# EAGLE design Battery_Monitoring_with_kill_Schematic (EAGLE 8.4.0)
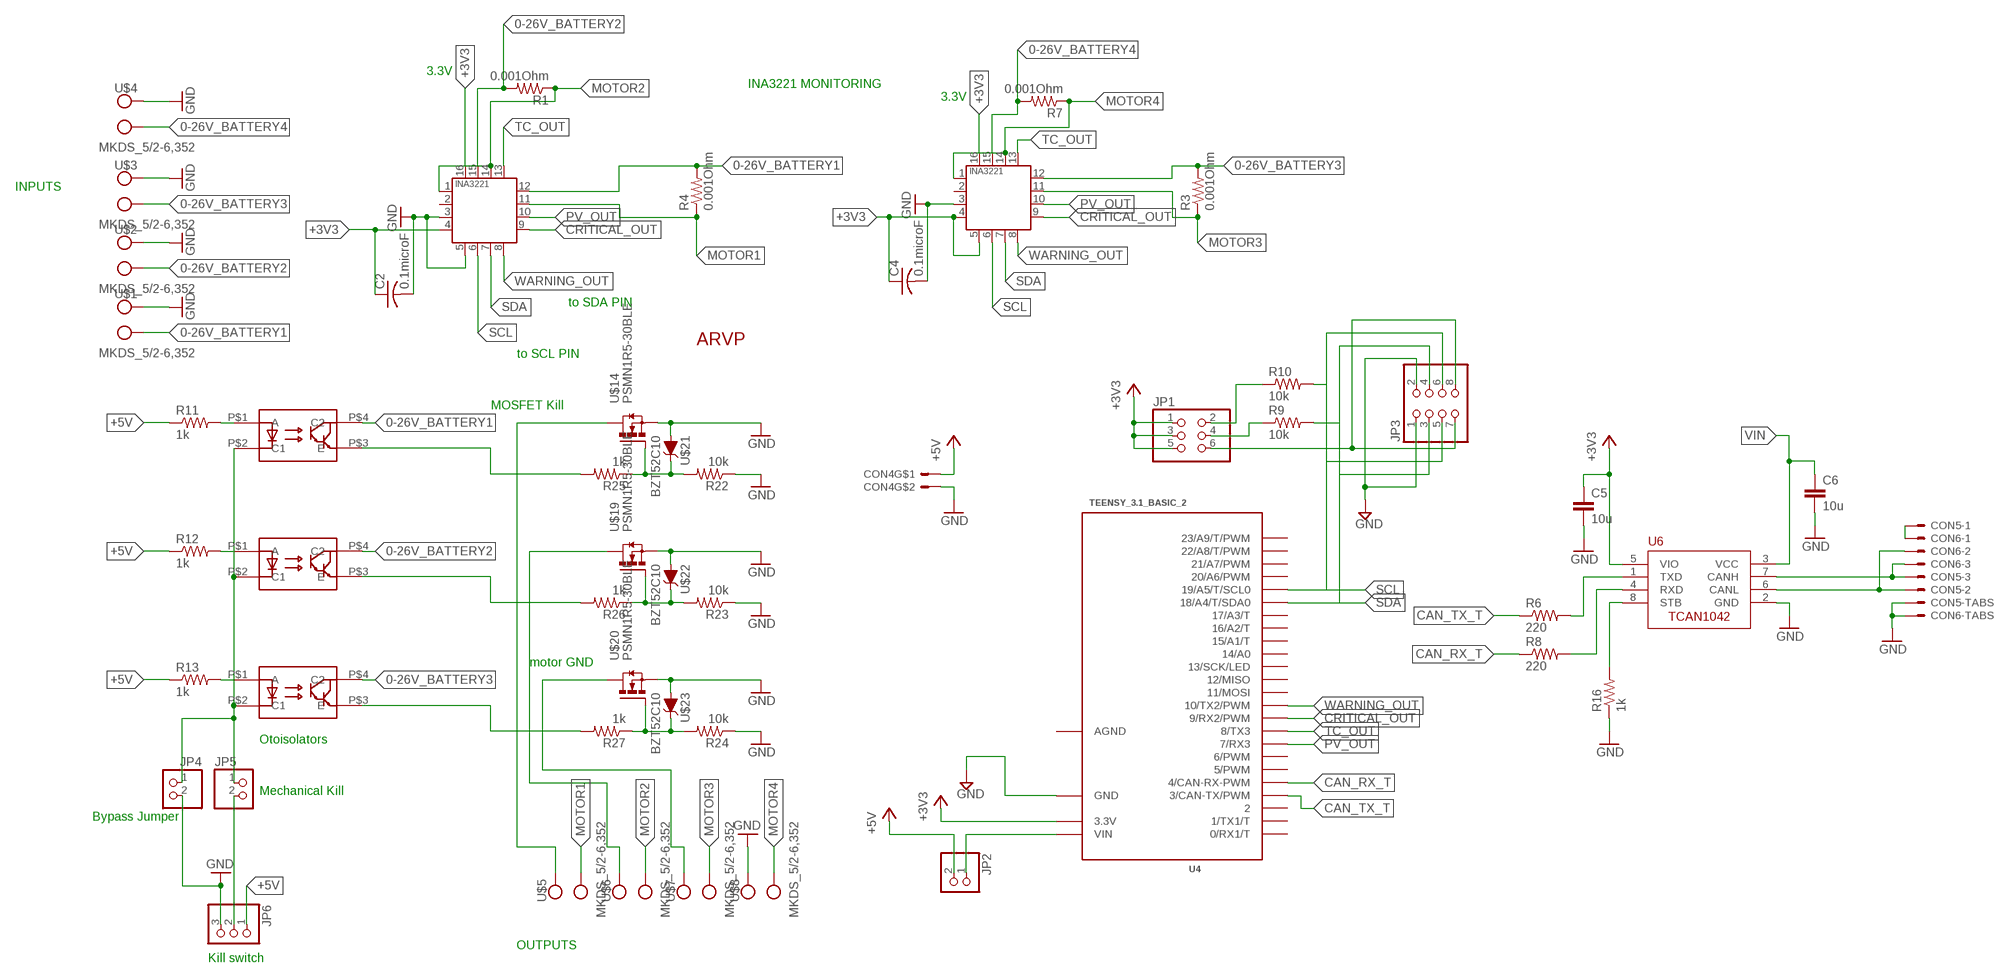
[diagram p0: schematic, sheet 1]

## Parts
C2  0.1microF  C-USC2012  [C2012]
C4  0.1microF  C-USC2012  [C2012]
C5  10u  C-EUC0805  [C0805]
C6  10u  C-EUC0805  [C0805]
CON4  MOLEX_5566-2  [5566-2]
CON5  S3B-PH-SM4-TB  [S3B-PH-SM4-TB]
CON6  S3B-PH-SM4-TB  [S3B-PH-SM4-TB]
JP1  PINHD-2X3  [2X03]
JP2  PINHD-1X2  [1X02]
JP3  PINHD-2X4  [2X04]
JP4  PINHD-1X2  [1X02]
JP5  PINHD-1X2  [1X02]
JP6  PINHD-1X3  [1X03]
R1  0.001Ohm  HCS3920FT1L00  [3920]
R3  0.001Ohm  HCS3920FT1L00  [3920]
R4  0.001Ohm  HCS3920FT1L00  [3920]
R6  220  R-US_R0805  [R0805]
R7  0.001Ohm  HCS3920FT1L00  [3920]
R8  220  R-US_R0805  [R0805]
R9  10k  R-US_R1206  [R1206]
R10  10k  R-US_R1206  [R1206]
R11  1k  R-US_R0805  [R0805]
R12  1k  R-US_R0805  [R0805]
R13  1k  R-US_R0805  [R0805]
R16  1k  R-US_R0805  [R0805]
R22  10k  R-US_M1206  [M1206]
R23  10k  R-US_M1206  [M1206]
R24  10k  R-US_M1206  [M1206]
R25  1k  R-US_M1206  [M1206]
R26  1k  R-US_M1206  [M1206]
R27  1k  R-US_M1206  [M1206]
U1  INA3221.  [HVQFN16_4X4]
U2  INA3221.  [HVQFN16_4X4]
U4  TEENSY_3.1_BASIC_2  [TEENSY_3.1_BASIC_2]
U6  TCAN1042HVDR  [SO-8]
U$1  MKDS_5/2-6,352  [MKDS_5/2-6,35]
U$2  MKDS_5/2-6,352  [MKDS_5/2-6,35]
U$3  MKDS_5/2-6,352  [MKDS_5/2-6,35]
U$4  MKDS_5/2-6,352  [MKDS_5/2-6,35]
U$5  MKDS_5/2-6,352  [MKDS_5/2-6,35]
U$6  MKDS_5/2-6,352  [MKDS_5/2-6,35]
U$7  MKDS_5/2-6,352  [MKDS_5/2-6,35]
U$8  MKDS_5/2-6,352  [MKDS_5/2-6,35]
U$10  ARVP_LOGO  [ARVP]
U$11  TCLD1000CT  [SOP-4L]
U$12  TCLD1000CT  [SOP-4L]
U$13  TCLD1000CT  [SOP-4L]
U$14  PSMN1R5-30BLE  [SOT404/D2PAK]
U$19  PSMN1R5-30BLE  [SOT404/D2PAK]
U$20  PSMN1R5-30BLE  [SOT404/D2PAK]
U$21  BZT52C10  [SOD-123]
U$22  BZT52C10  [SOD-123]
U$23  BZT52C10  [SOD-123]

## Nets
0-26V_BATTERY1: R4.P$2 U1.12(IN+1) U$1.1(KL) U$11.P$4(C2)
0-26V_BATTERY2: R1.P$2 U1.15(IN+2) U$2.1(KL) U$12.P$4(C2)
0-26V_BATTERY3: R3.P$2 U2.12(IN+1) U$3.1(KL) U$13.P$4(C2)
0-26V_BATTERY4: R7.P$2 U2.15(IN+2) U$4.1(KL)
+3V3: C2.1 C4.1 C5.1 JP1.1 JP1.3 JP1.5 U1.4(VS) U1.16(VPU) U2.4(VS) U2.5(A0) U2.16(VPU) U4.3.3V U6.5(VIO)
+5V: CON4.1 JP2.2 JP6.1 R11.1 R12.1 R13.1
CAN_RX1: R8.2 U6.4(RXD)
CAN_RX_T: R8.1 U4.4(4/CAN-RX-PWM)
CAN_TX2: R6.2 U6.1(TXD)
CAN_TX_T: R6.1 U4.3(3/CAN-TX/PWM)
CANH1: CON5.P$3 CON6.P$3 U6.7(CANH)
CANL1: CON5.P$2 CON6.P$2 U6.6(CANL)
CANSH1: CON5.P$1 CON6.P$1
CRITICAL_OUT: U1.9(CRITICAL) U2.9(CRITICAL) U4.9(9/RX2/PWM)
E1: R25.2 U$11.P$3(E)
E2: R26.2 U$12.P$3(E)
E3: R27.2 U$13.P$3(E)
GND: C2.2 C4.2 C5.2 C6.2 CON4.2 CON5.P$4 CON5.P$5 CON6.P$4 CON6.P$5 JP3.1 JP3.2 JP4.2 JP6.3 R16.1 R22.1 R23.1 R24.1 U1.3(GND) U1.5(A0) U2.3(GND) U4.GND U6.2(GND) U$1.2(KL1) U$2.2(KL1) U$3.2(KL1) U$4.2(KL1) U$8.2(KL1) U$14.3S(S) U$19.3S(S) U$20.3S(S) U$21.P$2(A) U$22.P$2(A) U$23.P$2(A)
I2C_3V1: JP1.6 JP3.7 JP3.8
MD1: U$5.2(KL1) U$14.2D(D)
MD2: U$6.2(KL1) U$19.2D(D)
MD3: U$7.2(KL1) U$20.2D(D)
MG1: R22.2 R25.1 U$14.1G(G) U$21.P$1(C)
MG2: R23.2 R26.1 U$19.1G(G) U$22.P$1(C)
MG3: R24.2 R27.1 U$20.1G(G) U$23.P$1(C)
MOTOR1: R4.P$1 U1.11(IN-1) U$5.1(KL)
MOTOR2: R1.P$1 U1.1(IN-3) U1.14(IN-2) U$6.1(KL)
MOTOR3: R3.P$1 U2.11(IN-1) U$7.1(KL)
MOTOR4: R7.P$1 U2.1(IN-3) U2.14(IN-2) U$8.1(KL)
N$1: R11.2 U$11.P$1(A)
N$2: R12.2 U$12.P$1(A)
N$3: R13.2 U$13.P$1(A)
N$4: JP4.1 JP5.1 U$11.P$2(C1) U$12.P$2(C1) U$13.P$2(C1)
N$5: JP5.2 JP6.2
PV_OUT: U1.10(PV) U2.10(PV) U4.7(7/RX3)
SCL: JP3.5 JP3.6 R10.2 U1.6(SCL) U2.6(SCL) U4.19/A5(19/A5/T/SCL0)
SCL_3V1: JP1.2 R10.1
SDA: JP3.3 JP3.4 R9.2 U1.7(SDA) U2.7(SDA) U4.18/A4(18/A4/T/SDA0)
SDA_3V1: JP1.4 R9.1
STB1: R16.2 U6.8(STB)
TC_OUT: U1.13(TC) U2.13(TC) U4.8(8/TX3)
VIN: C6.1 JP2.1 U4.VIN U6.3(VCC)
WARNING_OUT: U1.8(WARNING) U2.8(WARNING) U4.10(10/TX2/PWM)
Unconnected: U1.2(IN+3) U2.2(IN+3) U4.0(0/RX1/T) U4.1(1/TX1/T) U4.2 U4.5(5/PWM) U4.6(6/PWM) U4.11(11/MOSI) U4.12(12/MISO) U4.13(13/SCK/LED) U4.14/A0 U4.15/A1(15/A1/T) U4.16/A2(16/A2/T) U4.17/A3(17/A3/T) U4.20/A6(20/A6/PWM) U4.21/A7(21/A7/PWM) U4.22/A8(22/A8/T/PWM) U4.23/A9(23/A9/T/PWM)

## Notes on the sheet
- 3.3V
- INA3221 MONITORING
- 3.3V
- INPUTS
- to SDA PIN
- to SCL PIN
- MOSFET Kill
- motor GND
- Otoisolators
- Mechanical Kill
- Bypass Jumper
- OUTPUTS
- Kill switch

## Power pins joined to a net without a drawn wire
AGND: U4.AGND

## Library data of the parts
C2 C4 = resistor:C-US: CAPACITOR, American symbol
C5 C6 = rcl:C-EU: CAPACITOR, European symbol
CON4 = ARVP:MOLEX_5566-2
CON5 CON6 = ARVP:S3B-PH-SM4-TB
JP1 = pinhead:PINHD-2X3: PIN HEADER
JP2 JP4 JP5 = pinhead:PINHD-1X2: PIN HEADER
JP3 = pinhead:PINHD-2X4: PIN HEADER
JP6 = pinhead:PINHD-1X3: PIN HEADER
R1 R3 R4 R7 = Moira:HCS3920: 0.001 Ohm ±1% 5W Chip Resistor 4020 Automotive AEC-Q200, Current Sense, Moisture Resistant Metal Element Stackpole Electronics Inc. Digikey: HCS3920FT1L00CT-ND
R6 R8-R10 R16 = rcl:R-US_: RESISTOR, American symbol
R11-R13 R22-R27 = adafruit:R-US_: RESISTOR, American symbol
U1 U2 = INA3221:INA3221: The INA3221 is a three-channel, high-side current and bus voltage monitor with an I 2C- and SMBUScompatible interface. The INA3221 monitors both shunt voltage drops and bus supply voltages, in addition to having programmable conversion times and averaging modes for these signals. The INA3221 offers both critical and warning alerts to detect multiple programmable out-of-range conditions for each channel.
U4 = Teensy_3_Series_Board_v1.0:TEENSY_3.1_BASIC_2: Footprint for Teensy 3.1 board using all pin connections on the outer perimeter
U6 = ARVP:TCAN1042HVDR
U$1-U$8 = Moira:MKDS_5/2-6,35: CONN TERM BLOCK 2POS 6.35MM PCB, 2 Position Wire to Board Terminal Block Horizontal with Board 0.250" (6.35mm) Through Hole, Phoenix Contact (1714955), Digikey:277-1269-ND, MKDS 5/2-6,35 package adpated from Eagle library package MKDS 5/3-6,35
U$10 = ARVP:ARVP_LOGO
U$11 = Moira:TCLD1000CT: OPTOISOLTR 5KV DARLINGTON 4-SOP by VISHAY Digikey: TCLD1000CT_ND; SPICEPREFIX: E
U$12 U$13 = Moira:TCLD1000CT: OPTOISOLTR 5KV DARLINGTON 4-SOP by VISHAY Digikey: TCLD1000CT_ND
U$14 U$19 U$20 = Moira:PSMN1R5-30BLE: N-channel 30 V 1.5 mΩ logic level MOSFET in D2PAK by Nexperia USA Inc. Digikey: 1727-1101-1-ND
U$21-U$23 = Moira:BZT52C10: DIODE ZENER 10V 500MW SOD123 by Diodes Incorporated Digikey: BZT52C10-FDICT-ND

## Net classes
1 net1: clearance 0.203 mm to class 0

## Board
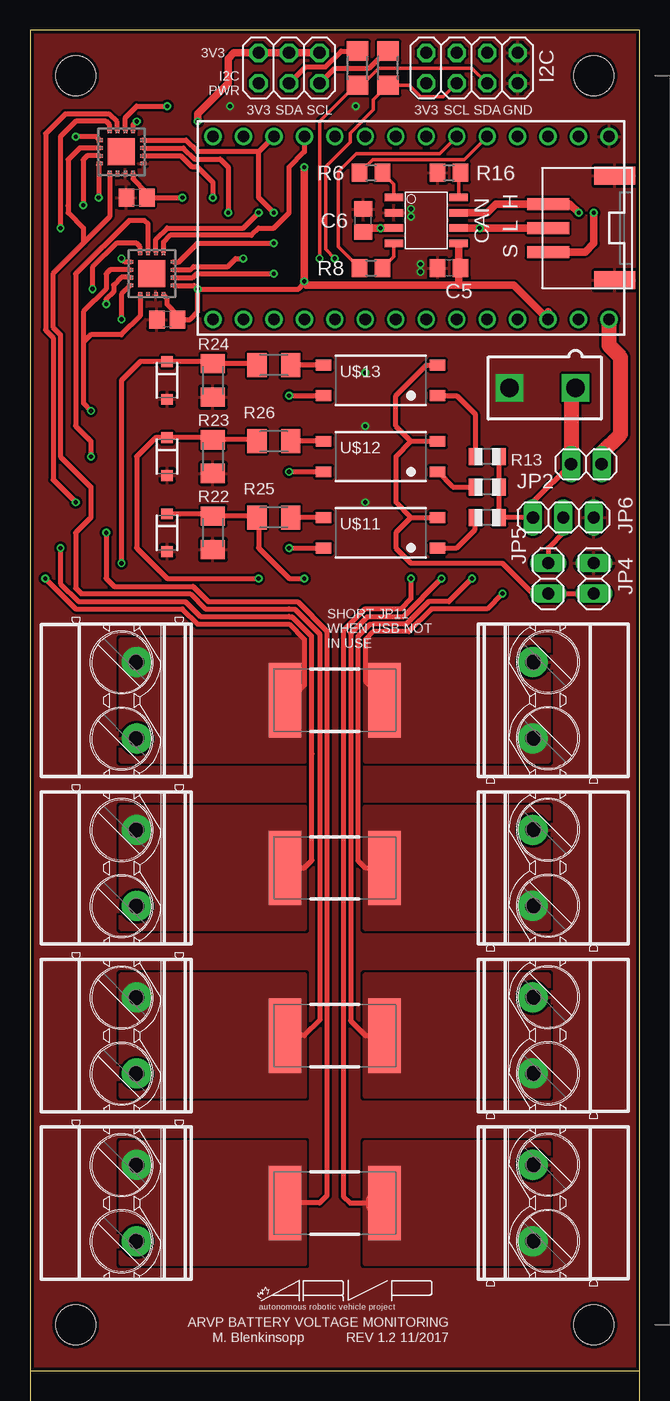
[diagram p1: board, top side]
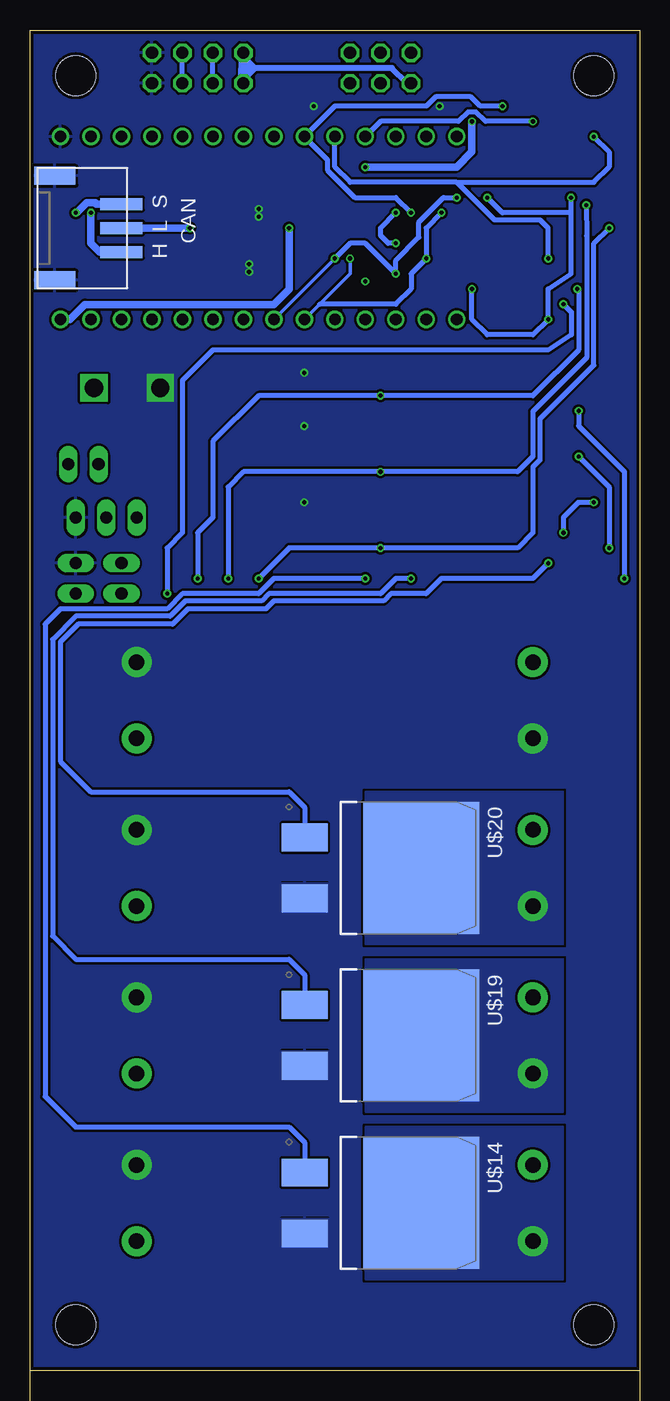
[diagram p2: board, bottom side, seen from below]

Size 50.8 x 111.76 mm. Coordinates in mm from the lower left corner, seen from the top.
Outline: 50.8,0 50.8,111.76 0,111.76 0,0 50.8,0
Copper layers (1*16): Top 0.035mm / dielectric 1.5mm / Bottom 0.035mm
Design rules "ITEADstudioDRC": minimum track width 6mil, minimum drill 12mil, track to track 8mil, track to pad 8mil, pad to pad 8mil, via to via 8mil, smd to smd 0mil, copper to edge 10mil, drill to drill 10mil, minimum pad ring 6mil, minimum via ring 6mil, stop-mask expansion 2mil, vias tented up to drill 100mil, thermal gap 10mil
Milling: 4 lines

### Footprints (pad centres in the part's own frame; a part is rotated, then mirrored left to right if it is on the bottom)
C2012 = smd 1.3 x 1.5: 1 -0.85,0; 2 0.85,0
C0805 = smd 1.3 x 1.5: 1 -0.95,0; 2 0.95,0
5566-2 = drill 1.524 square: 1 0,-2.756; 2 0,2.756
S3B-PH-SM4-TB = smd 1 x 3.5: P$1 -2,1.75; P$2 0,1.75; P$3 2,1.75 | smd 1.5 x 3.4: P$4 4.35,-3.8; P$5 -4.35,-3.8
2X03 = drill 1.016 octagon: 1 -2.54,-1.27; 2 -2.54,1.27; 3 0,-1.27; 4 0,1.27; 5 2.54,-1.27; 6 2.54,1.27
1X02 = drill 1.016 long: 1 -1.27,0; 2 1.27,0
2X04 = drill 1.016 octagon: 1 -3.81,-1.27; 2 -3.81,1.27; 3 -1.27,-1.27; 4 -1.27,1.27; 5 1.27,-1.27; 6 1.27,1.27; 7 3.81,-1.27; 8 3.81,1.27
1X03 = drill 1.016 long: 1 -2.54,0; 2 0,0; 3 2.54,0
3920 = smd 2.7 x 6.2: P$1 -4.15,0; P$2 4.15,0
R0805 = smd 1.3 x 1.5: 1 -0.95,0; 2 0.95,0
R1206 = smd 1.6 x 1.803: 1 -1.422,0; 2 1.422,0
R0805' = smd 1.1 x 1.4: 1 -1,0; 2 1,0
M1206 = smd 1.6 x 2: 1 -1.4,0; 2 1.4,0
HVQFN16_4X4 = smd 0.5 x 0.3: 1 -1.8,0.975; 2 -1.8,0.325; 3 -1.8,-0.325; 4 -1.8,-0.975; 9 1.8,-0.975; 10 1.8,-0.325; 11 1.8,0.325; 12 1.8,0.975 | smd 0.3 x 0.5: 5 -0.975,-1.8; 6 -0.325,-1.8; 7 0.325,-1.8; 8 0.975,-1.8; 13 0.975,1.8; 14 0.325,1.8; 15 -0.325,1.8; 16 -0.975,1.8 | smd 2.25 x 2.25: TH 0,0
TEENSY_3.1_BASIC_2 = drill 0.965: 0 -7.62,13.97; 1 -7.62,11.43; 2 -7.62,8.89; 3 -7.62,6.35; 3.3V 7.62,11.43; 4 -7.62,3.81; 5 -7.62,1.27; 6 -7.62,-1.27; 7 -7.62,-3.81; 8 -7.62,-6.35; 9 -7.62,-8.89; 10 -7.62,-11.43; 11 -7.62,-13.97; 12 -7.62,-16.51; 13 7.62,-16.51; 14/A0 7.62,-13.97; 15/A1 7.62,-11.43; 16/A2 7.62,-8.89; 17/A3 7.62,-6.35; 18/A4 7.62,-3.81; 19/A5 7.62,-1.27; 20/A6 7.62,1.27; 21/A7 7.62,3.81; 22/A8 7.62,6.35; 23/A9 7.62,8.89; AGND 7.62,13.97; GND -7.62,16.51; VIN 7.62,16.51
SO-8 = smd 1.524 x 0.61: 1 -2.692,1.905; 2 -2.692,0.635; 3 -2.692,-0.635; 4 -2.692,-1.905; 5 2.692,-1.905; 6 2.692,-0.635; 7 2.692,0.635; 8 2.692,1.905
MKDS_5/2-6,35 = drill 1.3 pad 2.5: 1 -3.175,0; 2 3.175,0
SOP-4L = smd 1.3 x 0.9: P$1 -4.75,1.27; P$2 -4.75,-1.27; P$3 4.75,-1.27; P$4 4.75,1.27
SOT404/D2PAK = smd 2.32 x 3.81: 1G -2.54,-6.32; 3S 2.54,-6.32 | smd 11 x 9.65: 2D 0,3.4
STAND-OFF = hole 3.302: 0,0
SOD-123 = smd 0.9 x 0.95: P$1 -1.575,0; P$2 1.575,0

### Placement (x,y rotation side)
C2  8.89,97.79 180 top
C4  11.43,87.63 180 top
C5  34.92,91.92 180 top
C6  27.78,95.88 90 top
CON4  42.7,81.91 90 top
CON5  44.93,95.25 90 top
CON6  44.93,95.25 270 bottom
JP1  21.59,108.59 180 top
JP2  46.36,75.56 180 top
JP3  36.83,108.59 180 top
JP4  46.99,66.04 90 top
JP5  43.18,66.04 90 top
JP6  44.45,71.12 0 top
R1  25.4,27.94 0 top
R3  25.4,41.91 0 top
R4  25.4,13.97 0 top
R6  28.42,99.85 0 top
R7  25.4,55.88 0 top
R8  28.42,91.92 0 top
R9  27.3,108.59 270 top
R10  29.85,108.59 270 top
R11  1k  [R0805']  38.1,71.12 180 top
R12  1k  [R0805']  38.1,73.66 180 top
R13  1k  [R0805']  38.1,76.2 180 top
R16  34.92,99.85 0 top
R22  15.24,69.85 90 top
R23  15.24,76.2 90 top
R24  15.24,82.55 90 top
R25  20.32,71.12 0 top
R26  20.32,77.47 0 top
R27  20.32,83.82 0 top
U1  7.62,101.6 90 top
U2  10.16,91.44 90 top
U4  31.75,95.25 270 top
U6  33.02,95.88 0 top
U$1  41.91,13.97 90 top
U$2  41.91,27.94 90 top
U$3  41.91,41.91 90 top
U$4  41.91,55.88 90 top
U$5  8.89,13.97 270 top
U$6  8.89,27.94 270 top
U$7  8.89,41.91 270 top
U$8  8.89,55.88 270 top
U$10  19.05,5.08 0 top
U$11  29.21,69.85 180 top
U$12  29.21,76.2 180 top
U$13  29.21,82.55 180 top
U$14  21.59,13.97 270 bottom
U$18  [STAND-OFF]  46.99,107.95 90 top
U$19  21.59,27.94 270 bottom
U$20  21.59,41.91 270 bottom
U$21  11.43,69.85 270 top
U$22  11.43,76.2 270 top
U$23  11.43,82.55 270 top
U$24  [STAND-OFF]  46.99,3.81 90 top
U$25  [STAND-OFF]  3.81,3.81 90 top
U$26  [STAND-OFF]  3.81,107.95 90 top

### Tracks (layer width: path | path; a pad name or v marks a point on that pad's centre or on a via)
0-26V_BATTERY1  (via drill 0.35)
  Top 0.406: U1.12 6.64,103.84 6.35,104.14 3.81,104.14 2.54,102.87 v2.54,95.25 | v21.59,68.58 U$11.P$4 | 29.21,13.97 26.67,13.97 26.11,14.53 26.11,61.72 27.84,63.45 27.89,63.45 27.94,63.5 30.89,63.5 31.75,64.36 v31.75,66.04
  Top 2.54: 29.21,13.97 R4.P$2
  Bottom 0.406: v2.54,95.25 3.81,93.98 3.81,83.82 8.28,79.35 8.28,75.95 8.89,75.34 8.89,69.85 10.16,68.58 v21.59,68.58 29.21,68.58 v31.75,66.04
  pour Top (no thermals): 27.94,8.89 27.94,19.05 43.18,19.05 43.18,8.89
0-26V_BATTERY2  (via drill 0.35)
  Top 0.406: U1.15 4.75,101.28 4.42,100.94 4.42,97.18 v4.44,97.16 | v21.59,74.93 U$12.P$4 | R1.P$2 27.94,27.94 26.72,29.16 26.72,61.46 28.1,62.84 31.09,62.84 v34.29,66.04
  Bottom 0.406: v4.44,97.16 4.42,94.59 4.42,84.43 8.89,79.96 8.89,76.2 10.16,74.93 v21.59,74.93 33.02,74.93 34.29,73.66 v34.29,66.04
  pour Top (no thermals): 27.94,22.86 27.94,33.02 43.18,33.02 43.18,22.86
0-26V_BATTERY3  (via drill 0.35)
  Top 0.406: U2.12 9.19,93.69 8.89,93.98 7.21,93.98 5.2,91.97 v5.2,90.17 | v21.59,81.28 U$13.P$4 | v36.83,66.04 34.9,64.11 33.22,64.11 31.34,62.23 28.58,62.23 28.55,62.2 28.32,62.2 27.33,61.21 27.33,42.52 27.94,41.91 R3.P$2
  Bottom 0.406: v5.2,90.17 5.08,90.05 5.08,85.09 8.89,81.28 v21.59,81.28 31.75,81.28 35.56,77.47 35.56,71.12 36.83,69.85 v36.83,66.04
  pour Top (no thermals): 27.94,36.83 27.94,46.99 43.18,46.99 43.18,36.83
0-26V_BATTERY4  (via drill 0.35)
  Top 0.406: U2.15 8.32,91.16 7.62,91.16 6.96,90.5 6.96,89.92 6.35,89.31 v6.35,88.9 | 30.48,56.81 R7.P$2 27.94,57.49 27.94,60.96 28.58,61.59 31.57,61.59 33.47,63.5 38.1,63.5 v39.37,64.77
  Bottom 0.406: v6.35,88.9 5.69,88.24 5.69,86.36 7.62,85.09 35.56,85.09 38.1,82.55 38.1,69.85 39.37,68.58 v39.37,64.77
  pour Top (no thermals): 27.94,50.8 27.94,60.96 43.18,60.96 43.18,50.8
+3V3  (via drill 0.35)
  Top 0.406: U2.4 11.43,89.34 11.43,88.9 12.28,88.05 C4.1 13.33,87.63 13.97,88.27 v13.97,90.17 | U1.4 8.59,99.35 9.74,98.21 C2.1 v12.7,97.79 | U1.16 5.72,100.52 v5.72,97.79 | U2.16 7.62,89.72 v7.62,87.63 | v13.97,90.17 13.67,90.47 U2.5 | v13.97,90.17 22.38,90.17 22.86,90.65 v22.86,90.81
  Top 0.61: v13.97,104.14 13.97,104.78 16.51,107.31 16.51,109.38 16.99,109.85 JP1.5 JP1.3 JP1.1 | 35.71,92.08 U6.5 | 35.71,92.08 C5.1 35.72,91.76 35.72,90.49 | 35.71,91.92 35.71,92.08 | 43.18,88.27 U4.3.3V 40.32,90.49 35.72,90.49 | 35.72,90.49 23.02,90.49 22.86,90.65 v22.86,90.81 v22.86,100.33
  Bottom 0.406: 5.72,96.52 v5.72,97.79 | 5.72,96.52 11.43,96.52 v12.7,97.79 | v13.97,90.17 13.97,87.63 12.7,86.36 8.89,86.36 v7.62,87.63 7.62,90.17 5.72,91.44 5.72,96.52
  Bottom 0.61: v13.97,104.14 13.97,101.6 15.24,100.33 v22.86,100.33
+5V
  Top 0.406: JP2.2 41.91,72.39 JP6.1 R11.1 R12.1 R13.1
  Top 1.27: JP2.2 45.08,81.54 CON4.1
CAN_RX1
  Top 0.305: U6.4 30.33,92.88 R8.2
CAN_RX_T
  Top 0.305: U4.4 34.16,101.47 27.18,101.47 25.67,99.96 25.67,93.71 R8.1
CAN_TX2
  Top 0.305: U6.1 30.33,98.89 R6.2
CAN_TX_T
  Top 0.305: U4.3 36.19,100.96 28.57,100.96 28.36,100.75 R6.1
CANH1  (via drill 0.35)
  Top 0.61: U6.7 38.1,96.52 38.83,97.25 CON5.P$3 44.99,97.25 v45.72,96.52
  Bottom 0.61: v45.72,96.52 45.72,93.98 44.99,93.25 CON6.P$3
CANL1  (via drill 0.35)
  Top 0.61: U6.6 v37.46,95.25 CON6.P$2
  Bottom 0.61: v37.46,95.25 CON6.P$2
CANSH1  (via drill 0.35)
  Top 0.61: CON5.P$1 46.26,93.25 46.99,93.98 v46.99,96.52
  Bottom 0.61: v46.99,96.52 46.9,96.52 46.07,97.35 45.37,97.35 45.27,97.25 CON6.P$1
CRITICAL_OUT  (via drill 0.35)
  Top 0.406: U1.9 8.59,103.84 v8.89,104.14 | U2.9 11.14,94.09 11.68,94.64 18.44,94.64 19.05,95.25 20.32,95.25 21.59,96.52 21.59,100.33 22.86,101.6 U4.9
  Bottom 0.406: v8.89,104.14 12.86,104.14 13.64,104.93 14.3,104.93 15.08,104.14 21.59,104.14 U4.9
E1
  Top 0.406: U$11.P$3 R25.2
E2
  Top 0.406: U$12.P$3 R26.2
E3
  Top 0.406: U$13.P$3 R27.2
GND  (via drill 0.35)
  Top 0.406: 10.48,87.72 C4.2 | 7.94,97.88 C2.2
  other vias: 32.54,92.23 32.54,91.6 31.75,96.84 31.75,96.2 16.67,105.41 27.15,105.41 27.94,83.19 27.94,78.74 27.94,72.39
  pour Top (no thermals): 42.07,80.49 42.07,83.34 37.94,83.34 37.94,80.49
  pour Bottom (no thermals): 42.07,80.49 42.07,83.34 37.94,83.34 37.94,80.49
  pour Bottom (rank 2): 50.48,0.32 50.48,111.44 0.32,111.44 0.32,0.32
  pour Top (rank 3): 50.48,0.32 50.48,111.44 0.32,111.44 0.32,0.32
  pour Bottom (no thermals): 25.4,12.7 25.4,9.52 30.48,9.52 30.48,12.7
  pour Bottom (no thermals): 25.4,26.67 25.4,23.49 30.48,23.49 30.48,26.67
  pour Bottom (no thermals): 25.4,40.64 25.4,37.46 30.48,37.46 30.48,40.64
  pour Bottom (no thermals): 6.35,54.61 6.35,50.16 11.43,50.16 11.43,54.61
  pour Bottom (no thermals): 39.37,60.96 39.37,56.52 44.45,56.52 44.45,60.96
  pour Bottom (no thermals): 39.37,46.99 39.37,42.55 44.45,42.55 44.45,46.99
  pour Bottom (no thermals): 39.37,33.02 39.37,28.57 44.45,28.57 44.45,33.02
  pour Bottom (no thermals): 39.37,19.05 39.37,14.6 44.45,14.6 44.45,19.05
I2C_3V1
  Bottom 0.508: JP1.6 19.37,107.31 20.64,108.59 33.02,108.59 | 33.02,109.54 32.07,108.59 33.02,107.63
  Bottom 0.813: JP3.7 33.02,109.54 33.02,108.59 33.02,107.63 JP3.8
MD1
  pour Bottom (no thermals): 22.86,20.32 22.86,7.62 6.35,7.62 6.35,20.32
MD2
  pour Bottom (no thermals): 22.86,34.29 22.86,21.59 6.35,21.59 6.35,34.29
MD3
  pour Bottom (no thermals): 22.86,48.26 22.86,35.56 6.35,35.56 6.35,48.26
MG1  (via drill 0.35)
  Top 0.406: U$21.P$1 15.06,71.42 R22.2 18.79,71.25 R25.1 19.05,70.99 19.05,68.58 21.59,66.04 v22.86,66.04
  Bottom 0.406: U$14.1G 27.91,19.02 29.21,20.32 46.99,20.32 49.53,22.86 49.53,62.23 48.26,63.5 39.37,63.5 38.1,64.77 31.75,64.77 30.48,66.04 v22.86,66.04
MG2  (via drill 0.35)
  Top 0.406: R26.1 18.79,77.6 R23.2 15.06,77.78 U$22.P$1 10.47,77.78 8.89,76.2 8.89,68.58 11.43,66.04 v19.05,66.04
  Bottom 0.406: v19.05,66.04 20.32,66.04 21.59,64.77 30.89,64.77 31.5,64.16 37.85,64.16 39.12,62.89 46.99,62.89 48.92,60.96 48.92,36.22 46.99,34.29 29.21,34.29 27.91,32.99 U$19.1G
MG3  (via drill 0.35)
  Top 0.406: R27.1 18.79,83.95 R24.2 15.06,84.12 U$23.P$1 9.19,84.12 7.62,82.55 v7.62,67.31
  Bottom 0.406: v7.62,67.31 8.89,66.04 16.51,66.04 17.78,64.77 20.73,64.77 21.34,64.16 30.48,64.16 31.14,63.5 37.65,63.5 38.92,62.23 46.79,62.23 48.26,60.76 48.26,50.8 45.72,48.26 29.21,48.26 27.91,46.96 U$20.1G
MOTOR1  (via drill 0.35)
  Top 0.406: U1.11 7.25,103.44 7.25,104.1 6.6,104.75 2.92,104.75 1.3,103.12 1.3,86.74 1.93,86.11 1.93,74.27 v3.81,72.39 | v6.35,69.85 6.35,66.04 7.01,65.38 13.59,65.38 14.86,64.11 22.3,64.11 24.74,61.67 24.74,14.58 24.13,13.97 R4.P$1
  Bottom 0.406: v3.81,72.39 5.08,72.39 6.35,71.12 v6.35,69.85
  pour Top (no thermals): 7.62,8.89 7.62,19.05 22.86,19.05 22.86,8.89
MOTOR2
  Top 0.406: U1.14 4.14,101.93 3.17,100.97 3.17,97.16 3.15,97.13 3.17,97.1 3.17,96.52 4.44,95.25 4.44,93.98 | U1.1 6.64,96.18 4.44,93.98 | 4.44,93.98 1.91,91.44 1.91,87 2.54,86.36 2.54,76.2 5.08,73.66 5.08,71.12 3.81,69.85 3.81,65.22 4.26,64.77 13.33,64.77 14.61,63.5 21.59,63.5 21.61,63.48 22.07,63.48 24.13,61.41 24.13,29.21 22.86,27.94 R1.P$1
  pour Top (no thermals): 7.62,22.86 7.62,33.02 22.86,33.02 22.86,22.86
MOTOR3  (via drill 0.35)
  Top 0.406: U2.11 9.83,95.57 9.53,95.88 8.25,95.88 3.81,91.44 3.81,78.74 5.08,77.47 v5.08,76.2 | v2.54,68.58 2.54,65.63 4.06,64.11 12.95,64.11 14.2,62.87 21.59,62.87 21.61,62.84 21.84,62.84 23.47,61.21 23.47,51.46 23.5,51.44 23.5,42.55 22.86,41.91 R3.P$1
  Bottom 0.406: v5.08,76.2 2.54,73.66 v2.54,68.58
  pour Top (no thermals): 7.62,36.83 7.62,46.99 22.86,46.99 22.86,36.83
MOTOR4  (via drill 0.35)
  Top 0.406: U2.14 6.67,91.76 6.35,91.44 6.35,90.17 4.44,88.27 4.44,85.72 | U2.1 9.19,87.92 7.62,86.36 5.08,86.36 4.44,85.72 | 4.44,85.72 4.44,80.64 v5.08,80.01 | v1.27,66.04 3.81,63.5 12.7,63.5 13.97,62.23 21.59,62.23 22.86,60.96 22.86,57.15 21.59,55.88 R7.P$1
  Bottom 0.406: v5.08,80.01 5.08,78.74 1.27,74.93 v1.27,66.04
  pour Top (no thermals): 7.62,50.8 7.62,60.96 22.86,60.96 22.86,50.8
N$1
  Top 0.406: U$11.P$1 35.56,68.58 37.1,70.12 R11.2
N$2
  Top 0.406: R12.2 35.23,73.66 U$12.P$1
N$3
  Top 0.406: U$13.P$1 35.56,81.28 37.1,79.74 R13.2
N$4
  Top 0.406: JP4.1 JP5.1 41.91,64.77 39.37,67.31 31.75,67.31 30.48,68.58 30.48,69.85 31.75,71.12 | 31.75,77.47 30.48,78.74 30.48,81.28 33.02,83.82 U$13.P$2 | 31.75,77.47 30.48,76.2 30.48,72.39 31.75,71.12 | 31.75,77.47 U$12.P$2 | 31.75,71.12 U$11.P$2
N$5
  Top 0.406: JP6.2 44.45,69.85 43.18,68.58 JP5.2
PV_OUT  (via drill 0.35)
  Top 0.406: U1.10 7.94,104.47 8.89,105.41 v11.43,105.41 | U2.10 10.48,94.31 11.43,95.25 17.78,95.25 v19.05,96.52
  Bottom 0.406: v11.43,105.41 13.27,105.41 14.05,106.19 16.99,106.19 17.78,105.41 25.4,105.41 U4.7 26.01,100.94 26.01,100.08 23.72,97.79 20.32,97.79 v19.05,96.52
SCL  (via drill 0.35)
  Top 0.305: v25.4,92.71 24.64,93.47 24.64,100.36 26.67,102.39 26.67,103.17 28.62,105.13 28.62,105.94 R10.2 31.59,107.16 32.56,106.2 34.44,106.2 JP3.6
  Top 0.406: v20.32,91.44 13.88,91.44 13.55,91.12 U2.6 | U1.6 12.57,101.28 13.47,100.38 13.92,100.38 15.24,99.06 v15.24,97.79
  Bottom 0.305: v25.4,92.71 U4.19/A5
  Bottom 0.406: JP3.6 JP3.5 | v25.4,92.71 24.13,93.98 22.86,93.98 v20.32,91.44 20.32,92.55 18.39,94.48 18.39,95.75 16.35,97.79 v15.24,97.79
SCL_3V1
  Top 0.406: JP1.2 25.4,108.59 28.26,108.59 29.68,110.01 R10.1
SDA  (via drill 0.35)
  Top 0.305: v24.13,92.71 24.13,104.14 27.15,107.16 R9.2 27.63,107.16 29.05,108.59 36.83,108.59 JP3.4
  Top 0.406: U2.7 13.34,91.76 13.63,92.05 16.48,92.05 17.14,92.71 v17.78,92.71 | U1.7 12.78,101.93 13.72,100.99 15.85,100.99 16.51,100.33 v16.51,96.52
  Bottom 0.305: v24.13,92.71 24.13,91.44 26.67,88.9 U4.18/A4
  Bottom 0.406: JP3.4 JP3.3 | 26.67,88.9 20.32,88.9 19.05,90.17 19.05,91.44 v17.78,92.71 17.78,95.25 v16.51,96.52
SDA_3V1
  Top 0.406: JP1.4 22.96,108.69 24.61,108.69 25.93,110.01 R9.1
STB1
  Top 0.305: R16.2 35.71,99.69 U6.8
TC_OUT  (via drill 0.35)
  Top 0.406: U1.13 5.53,102.87 v3.81,102.87 | U2.13 7.92,92.41 v7.62,92.71
  Bottom 0.406: v3.81,102.87 2.54,101.6 2.54,100.33 3.81,99.06 15.24,99.06 | 15.24,99.06 24.13,99.06 25.4,100.33 U4.8 | v7.62,92.71 7.62,95.25 8.28,95.91 12.09,95.91 15.24,99.06
VIN  (via drill 0.35)
  Top 0.61: C6.1 27.94,95.25 v29.21,95.25 U6.3 30.48,95.25
  Top 1.27: JP2.1 47.62,76.48 49.23,78.08 49.23,84.48 48.26,85.45 U4.VIN
  Bottom 0.61: U4.VIN 47.48,87.63 46.24,88.88 30.51,88.88 29.21,90.17 v29.21,95.25
WARNING_OUT  (via drill 0.35)
  Top 0.406: U1.8 13,102.57 13.97,101.6 19.05,101.6 | U4.10 19.05,101.6 | U2.8 12.41,92.41 13.97,93.98 17.78,93.98 19.05,93.98 v20.32,93.98 | v20.32,96.52 19.05,97.79 19.05,101.6
  Bottom 0.406: v20.32,93.98 20.95,93.98 21.59,94.62 21.59,95.25 v20.32,96.52

### Text on the board
tPlace: ARVP BATTERY VOLTAGE MONITORING | M. Blenkinsopp | REV 1.2 11/2017
tNames: 3V3 | I2C | I2C / PWR | 3V3 | SDA | SCL | 3V3 | SCL | SDA | GND | H | CAN | L | S | SHORT JP11 / WHEN USB NOT / IN USE
bNames: S | CAN | L | H
tDocu: Bottom | Towards middle of robot | Towards acrylic wall | Assumptions: this board is installed in right/rear or left/front section of robot. / Teensy USB connector and CAN connector should point towards the center of hull. / Mounting holes come from Sparkfun library, located in projects folder. / Layout can be changed if needed, as long as USB and CAN guidelines are followed.